# Altium schematic sheet 5_CURRENT_SOURCE.SchDoc
size 420 x 297 mm; SheetNumber: 5; SheetTotal: 7
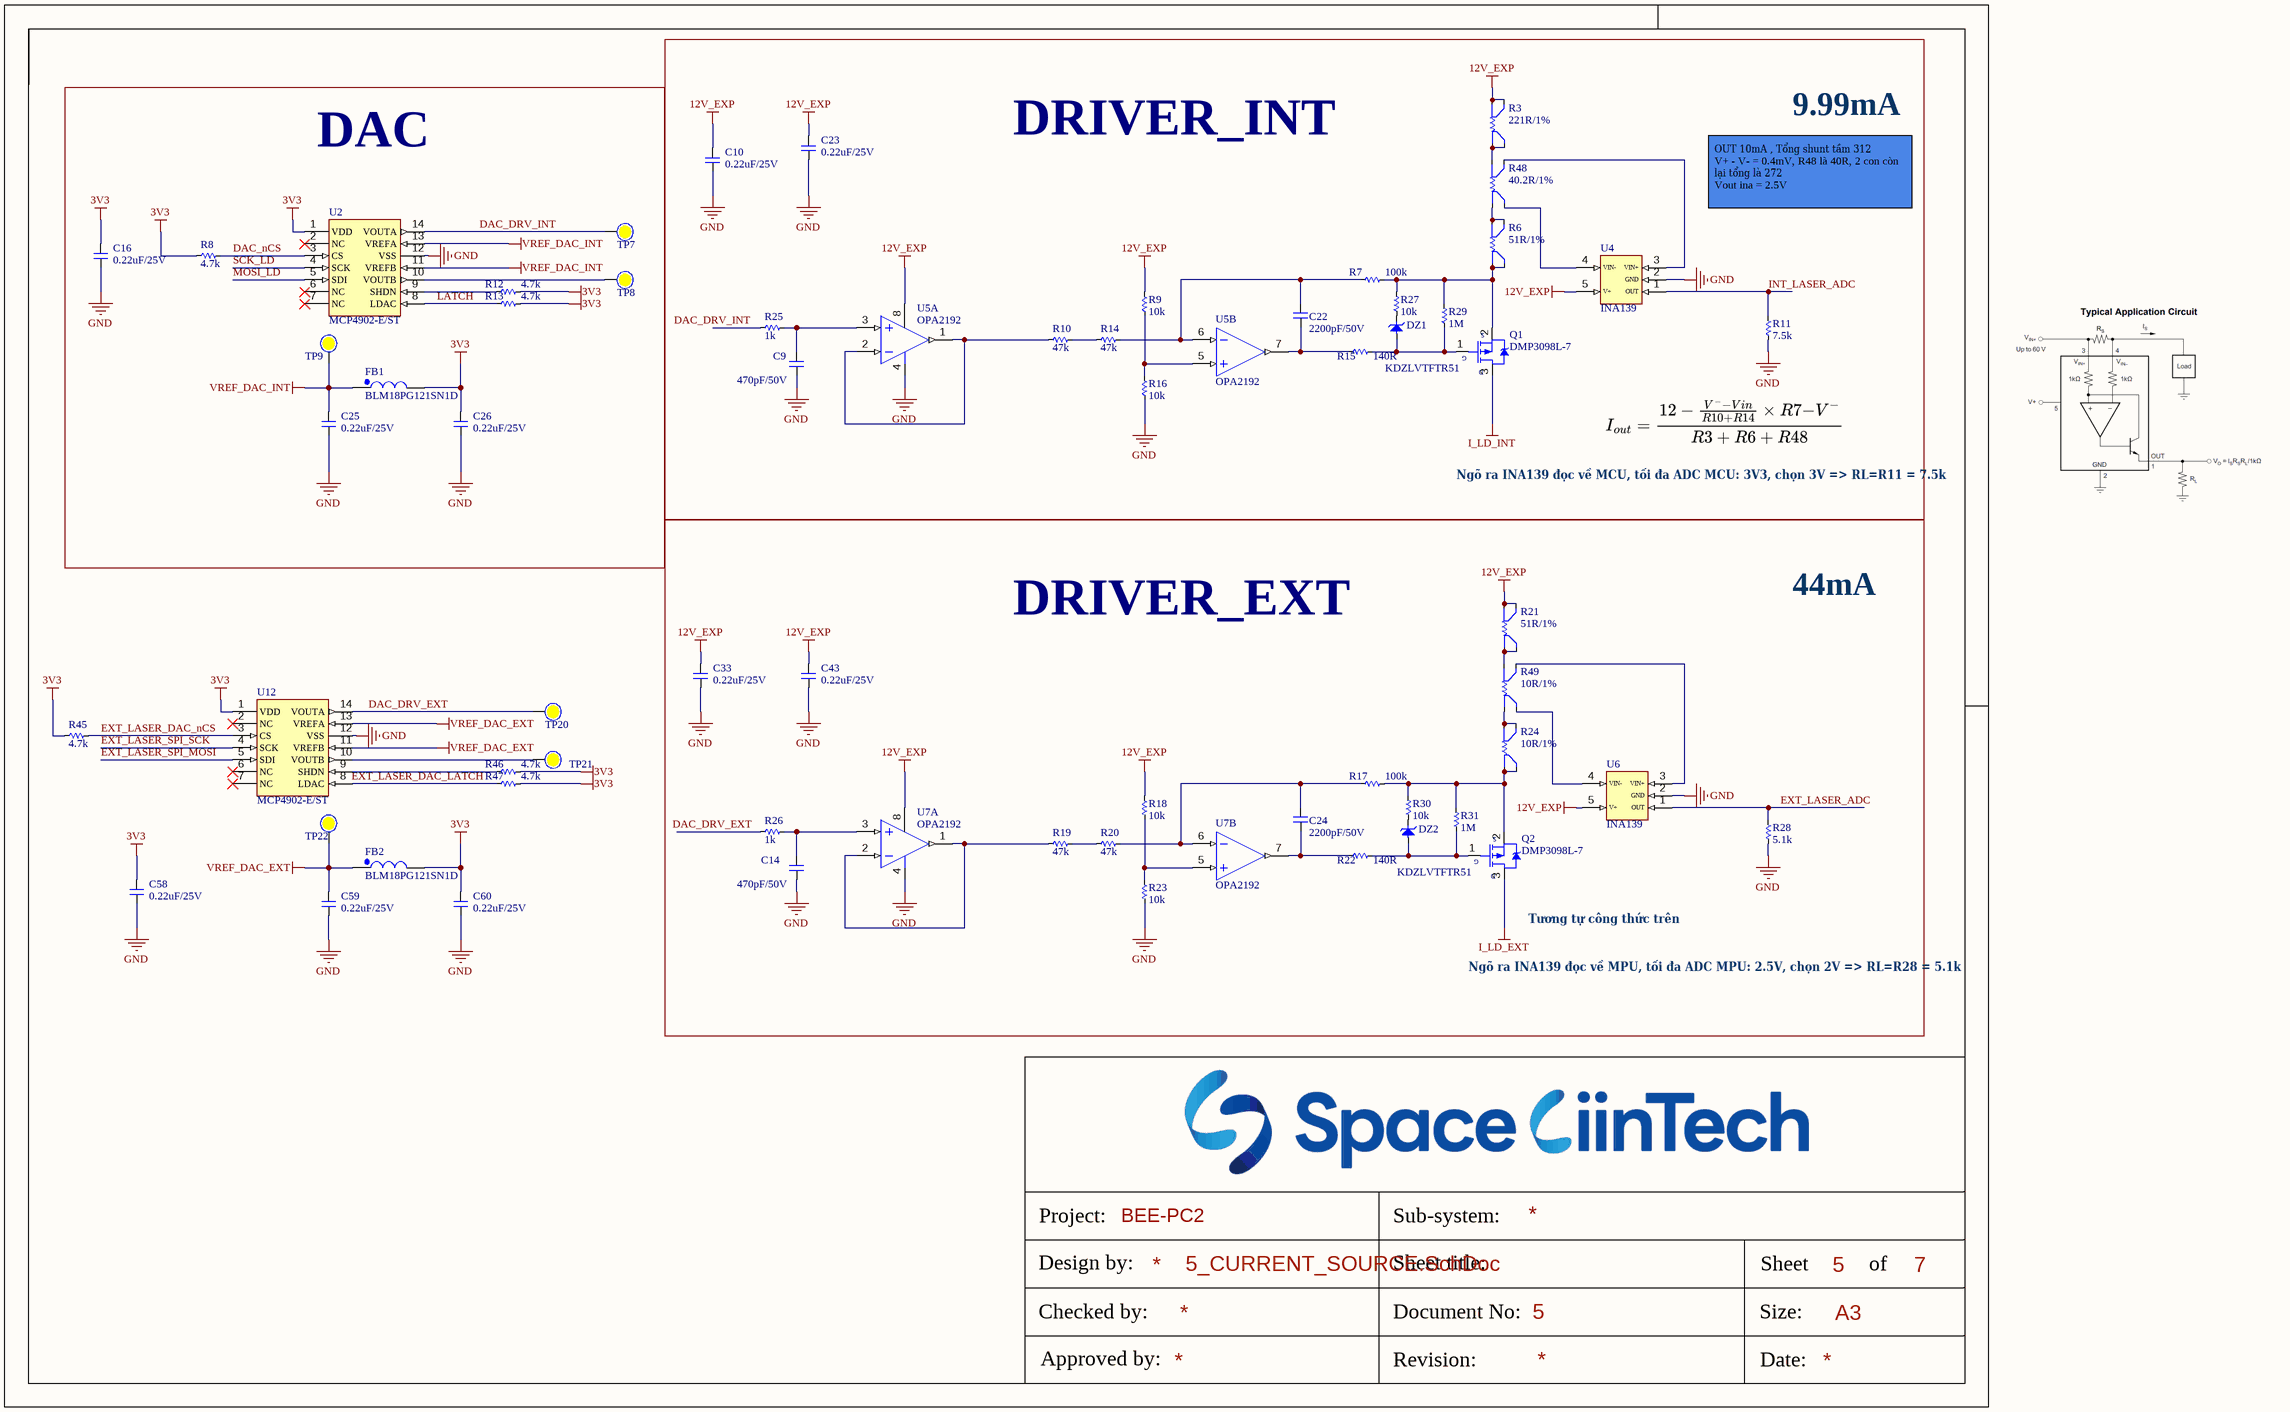
[diagram p0: 5_CURRENT_SOURCE.SchDoc]

## Parts
C9  470pF/50V  [CAP_C_1608X80]
C10  0.22uF/25V  [CAP_C_1608X80]
C14  470pF/50V  [CAP_C_1608X80]
C16  0.22uF/25V  [CAP_C_1608X80]
C22  2200pF/50V  [CAP_C_1608X80]
C23  0.22uF/25V  [CAP_C_1608X80]
C24  2200pF/50V  [CAP_C_1608X80]
C25  0.22uF/25V  [CAP_C_1608X80]
C26  0.22uF/25V  [CAP_C_1608X80]
C33  0.22uF/25V  [CAP_C_1608X80]
C43  0.22uF/25V  [CAP_C_1608X80]
C58  0.22uF/25V  [CAP_C_1608X80]
C59  0.22uF/25V  [CAP_C_1608X80]
C60  0.22uF/25V  [CAP_C_1608X80]
DZ1  KDZLVTFTR51  [SOD3717X145N]
DZ2  KDZLVTFTR51  [SOD3717X145N]
FB1  BLM18PG121SN1D  [IND_C_1608X60]
FB2  BLM18PG121SN1D  [IND_C_1608X60]
Q1  DMP3098L-7  [SOT23-3-132]
Q2  DMP3098L-7  [SOT23-3-132]
R3  221R/1%  [RES_SMD_0603_SHUNT]
R6  51R/1%  [RES_SMD_0603_SHUNT]
R7  100k  [RES_C_1608X60]
R8  4.7k  [RES_C_1608X60]
R9  10k  [RES_C_1608X60]
R10  47k  [RES_C_1608X60]
R11  7.5k  [RES_C_1608X60]
R12  4.7k  [RES_C_1608X60]
R13  4.7k  [RES_C_1608X60]
R14  47k  [RES_C_1608X60]
R15  140R  [RES_C_1608X60]
R16  10k  [RES_C_1608X60]
R17  100k  [RES_C_1608X60]
R18  10k  [RES_C_1608X60]
R19  47k  [RES_C_1608X60]
R20  47k  [RES_C_1608X60]
R21  51R/1%  [RES_SMD_0603_SHUNT]
R22  140R  [RES_C_1608X60]
R23  10k  [RES_C_1608X60]
R24  10R/1%  [RES_SMD_0603_SHUNT]
R25  1k  [RES_C_1608X60]
R26  1k  [RES_C_1608X60]
R27  10k  [RES_C_1005X40]
R28  5.1k  [RES_C_1608X60]
R29  1M  [RES_C_1005X40]
R30  10k  [RES_C_1005X40]
R31  1M  [RES_C_1005X40]
R45  4.7k  [RES_C_1608X60]
R46  4.7k  [RES_C_1608X60]
R47  4.7k  [RES_C_1608X60]
R48  40.2R/1%  [RES_SMD_0603_SHUNT]
R49  10R/1%  [RES_SMD_0603_SHUNT]
TP7  (no value)  [Testpoint_80]  (no BOM)
TP8  (no value)  [Testpoint_80]  (no BOM)
TP9  (no value)  [Testpoint_80]  (no BOM)
TP20  (no value)  [Testpoint_80]  (no BOM)
TP21  (no value)  [Testpoint_80]  (no BOM)
TP22  (no value)  [Testpoint_80]  (no BOM)
U2  MCP4902-E/ST  [TSSOP14]
U4  INA139  [SOT23-5]
U5  OPA2192  [SO8]  (parts A,B of 2)
U6  INA139  [SOT23-5]
U7  OPA2192  [SO8]  (parts A,B of 2)
U12  MCP4902-E/ST  [TSSOP14]

## Blocks framed on the sheet
DAC: C16 C25 C26 FB1 R8 R12 R13 TP7-TP9 U2
DRIVER_INT: C9 C10 C22 C23 DZ1 Q1 R3 R6 R7 R9-R11 R14-R16 R25 R27 R29 R48 U4 U5
DRIVER_EXT: C14 C24 C33 C43 DZ2 Q2 R17-R24 R26 R28 R30 R31 R49 U6 U7

## Nets
3V3: C16.2 C26.2 C58.2 C60.2 FB1.2 FB2.2 R8.1 R12.2 R13.2 R45.1 R46.2 R47.2 U2.1(VDD) U12.1(VDD)
12V_EXP: C10.2 C23.2 C33.2 C43.2 R3.1 R3.3 R9.1 R18.1 R21.1 R21.3 U4.5(V+) U5.8(+V) U6.5(V+) U7.8(+V)
GND: C9.1 C10.1 C14.1 C16.1 C23.1 C25.1 C26.1 C33.1 C43.1 C58.1 C59.1 C60.1 R11.2 R16.2 R23.2 R28.2 U2.12(VSS) U4.2(GND) U5.4(-V) U6.2(GND) U7.4(-V) U12.12(VSS)
I_LD_EXT: Q2.3(D)
I_LD_INT: Q1.3(D)
VREF_DAC_EXT: C59.2 FB2.1 TP22.1 U12.11(VREFB) U12.13(VREFA)
VREF_DAC_INT: C25.2 FB1.1 TP9.1 U2.11(VREFB) U2.13(VREFA)
DAC_DRV_EXT: R26.1 TP20.1 U12.14(VOUTA)
DAC_DRV_INT: R25.1 TP7.1 U2.14(VOUTA)
DAC_nCS: R8.2 U2.3(CS)
EXT_LASER_ADC: R28.1 U6.1(OUT)
EXT_LASER_DAC_LATCH: R47.1 U12.8(LDAC)
EXT_LASER_DAC_nCS: R45.2 U12.3(CS)
EXT_LASER_SPI_MOSI: U12.5(SDI)
EXT_LASER_SPI_SCK: U12.4(SCK)
INT_LASER_ADC: R11.1 U4.1(OUT)
LATCH: R13.1 U2.8(LDAC)
MOSI_LD: U2.5(SDI)
SCK_LD: U2.4(SCK)
NetC9_2: C9.2 R25.2 U5.3(IN+)
NetC14_2: C14.2 R26.2 U7.3(IN+)
NetC22_1: C22.1 R7.1 R14.2 U5.6(IN-)
NetC22_2: C22.2 R15.1 U5.7(OUT)
NetC24_1: C24.1 R17.1 R20.2 U7.6(IN-)
NetC24_2: C24.2 R22.1 U7.7(OUT)
NetDZ1_1: DZ1.1(K) R27.1
NetDZ1_2: DZ1.2(A) Q1.1(G) R15.2 R29.1
NetDZ2_1: DZ2.1(K) R30.1
NetDZ2_2: DZ2.2(A) Q2.1(G) R22.2 R31.1
NetQ1_2: Q1.2(S) R6.2 R6.4 R7.2 R27.2 R29.2
NetQ2_2: Q2.2(S) R17.2 R24.2 R24.4 R30.2 R31.2
NetR3_2: R3.2 R3.4 R48.1
NetR6_1: R6.1 R6.3 R48.2
NetR9_2: R9.2 R16.1 U5.5(IN+)
NetR10_1: R10.1 U5.1(OUT) U5.2(IN-)
NetR10_2: R10.2 R14.1
NetR12_1: R12.1 U2.9(SHDN)
NetR18_2: R18.2 R23.1 U7.5(IN+)
NetR19_1: R19.1 U7.1(OUT) U7.2(IN-)
NetR19_2: R19.2 R20.1
NetR21_2: R21.2 R21.4 R49.1
NetR24_1: R24.1 R24.3 R49.2
NetR46_1: R46.1 U12.9(SHDN)
NetR48_3: R48.3 U4.3(VIN+)
NetR48_4: R48.4 U4.4(VIN-)
NetR49_3: R49.3 U6.3(VIN+)
NetR49_4: R49.4 U6.4(VIN-)
NetTP8_1: TP8.1 U2.10(VOUTB)
NetTP21_1: TP21.1 U12.10(VOUTB)

Not connected (* = marked no-connect by the designer): U2 2(NC)* 6(NC)* 7(NC)*; U12 2(NC)* 6(NC)* 7(NC)*

## Notes on the sheet
- 9.99mA
- OUT 10mA , Tổng shunt tầm 312
  V+ - V- = 0.4mV, R48 là 40R, 2 con còn lại tổng là 272
  Vout ina = 2.5V
- Ngõ ra INA139 đọc về MCU, tối đa ADC MCU: 3V3, chọn 3V => RL=R11 = 7.5k
- 44mA
- Tương tự công thức trên
- Ngõ ra INA139 đọc về MPU, tối đa ADC MPU: 2.5V, chọn 2V => RL=R28 = 5.1k
- BEE-PC2
- Project:
- Sub-system:
- Design by:
- Sheet title:
- Sheet
- A3
- of
- Checked by:
- Approved by:
- Revision:
- Document No:
- Size:
- Date:

## Library data of the parts
C9 C10 C14 C16 C22-C26 C33 C43 C58-C60 = _CAP_C_2: CAP
DZ1 DZ2 = DIODE Zener: Zenner
FB1 FB2 = _IND
Q1 Q2 = P_MOSFET
R3 R6 R21 R48 = RES_SMD_SHUNT: RN73R1JTTD30R0B25
R7-R20 R22 R23 R25-R31 R45-R47 = _RES_B_2: RES
R24 R49 = RES_SMD_SHUNT: RT0603BRD077R5L
TP7-TP9 TP20-TP22 = Test Point: Solder: NF
U2 U12 = MCP4902
U4 U6 = INA139: INA139NA/250
U5 U7 = LM358: OPA2192IDR; Value: LM358